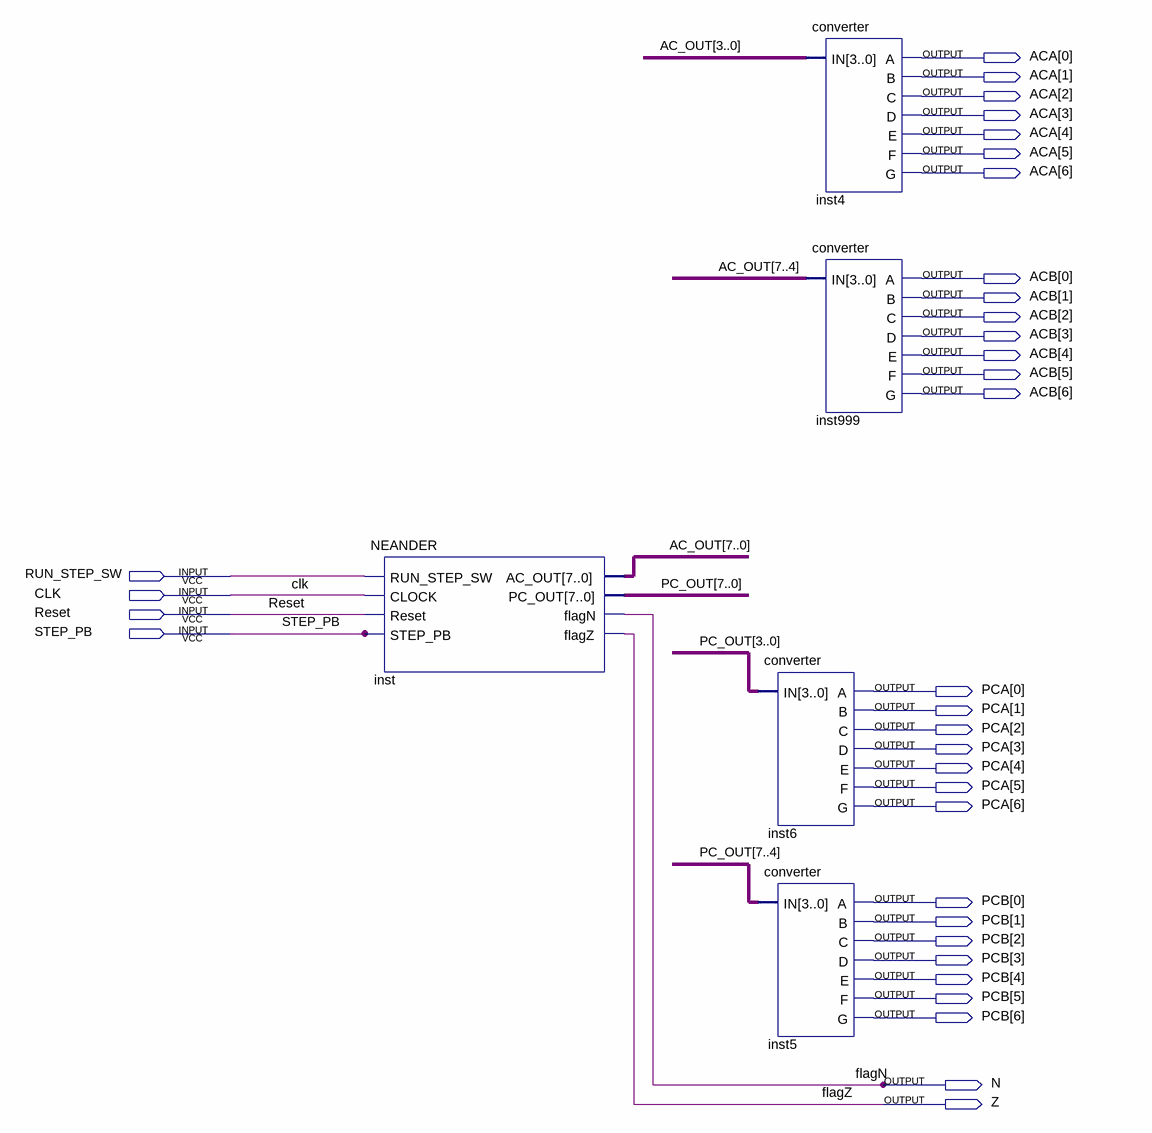
[diagram p0: schematic sheet]
// Quartus schematic NEANDER_W_7SEG.bdf as structural Verilog: 5 symbols, 34 pins
module NEANDER_W_7SEG (
  input  RUN_STEP_SW,
  input  CLK,
  input  Reset,
  input  STEP_PB,
  output [6:0] ACA,
  output [6:0] ACB,
  output [6:0] PCA,
  output [6:0] PCB,
  output N,
  output Z
);

  wire [7:0] AC_OUT, PC_OUT;

  NEANDER inst (
    .RUN_STEP_SW(RUN_STEP_SW), .CLOCK(CLK), .Reset(Reset), .STEP_PB(STEP_PB), .AC_OUT(AC_OUT),
    .PC_OUT(PC_OUT), .flagN(N), .flagZ(Z));
  converter inst6 (
    .IN(PC_OUT[3:0]), .A(PCA[0]), .B(PCA[1]), .C(PCA[2]), .D(PCA[3]), .E(PCA[4]), .F(PCA[5]), .G(PCA[6]));
  converter inst5 (
    .IN(PC_OUT[7:4]), .A(PCB[0]), .B(PCB[1]), .C(PCB[2]), .D(PCB[3]), .E(PCB[4]), .F(PCB[5]), .G(PCB[6]));
  converter inst4 (
    .IN(AC_OUT[3:0]), .A(ACA[0]), .B(ACA[1]), .C(ACA[2]), .D(ACA[3]), .E(ACA[4]), .F(ACA[5]), .G(ACA[6]));
  converter inst999 (
    .IN(AC_OUT[7:4]), .A(ACB[0]), .B(ACB[1]), .C(ACB[2]), .D(ACB[3]), .E(ACB[4]), .F(ACB[5]), .G(ACB[6]));

  // Other names for the same wires on the sheet: flagN = N; flagZ = Z
endmodule
